# Altium schematic sheet TOP.SchDoc
size A4; SheetNumber: 1; SheetTotal: 7
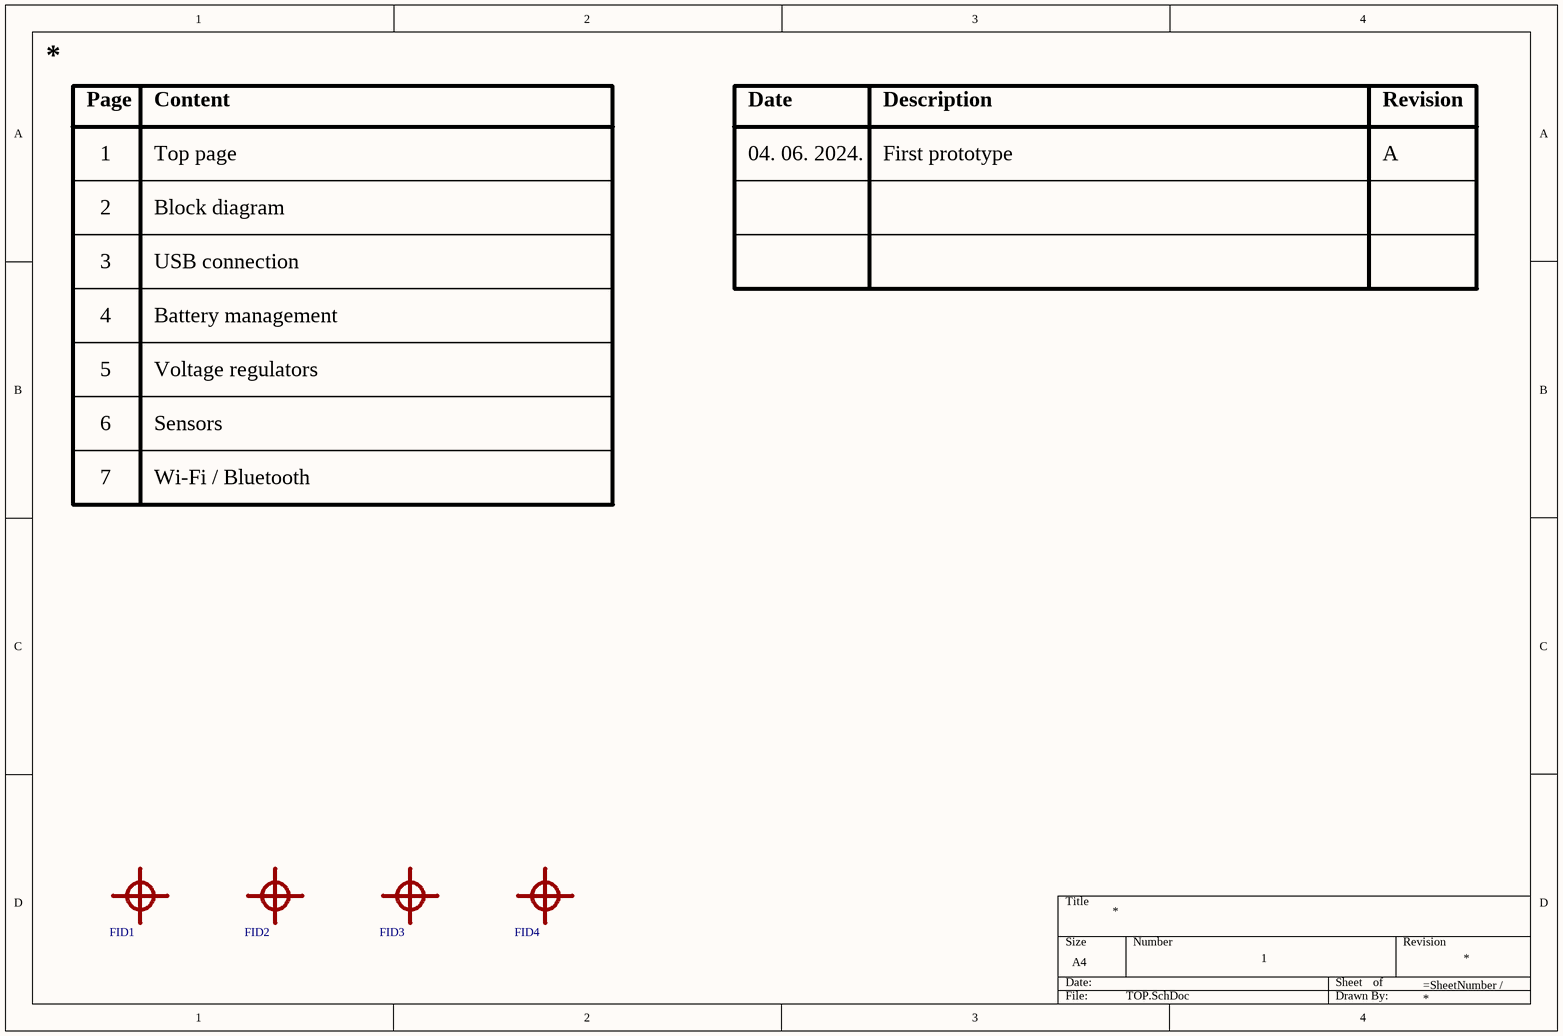
[diagram p0: TOP.SchDoc]

## Parts
FID1  FID  [FIDUCIAL]  (value not drawn)  (no BOM)
FID2  FID  [FIDUCIAL]  (value not drawn)  (no BOM)
FID3  FID  [FIDUCIAL]  (value not drawn)  (no BOM)
FID4  FID  [FIDUCIAL]  (value not drawn)  (no BOM)

## Notes on the sheet
- Page
- Content
- Date
- Description
- Revision
- 1
- Top page
- 04. 06. 2024.
- First prototype
- A
- 2
- Block diagram
- 3
- USB connection
- 4
- 5
- Battery management
- Voltage regulators
- 6
- Sensors
- 7
- Wi-Fi / Bluetooth

## Library data of the parts
FID1-FID4 = FIDUCIAL: Fiducial marker; Checked: Yes; Footprint: ?; MFR: ?; Supplier: Digi-Key; SPN: ?; MFRN: ?